# Altium schematic sheet Sheet1.SchDoc
size A; SheetNumber: 1; SheetTotal: 1
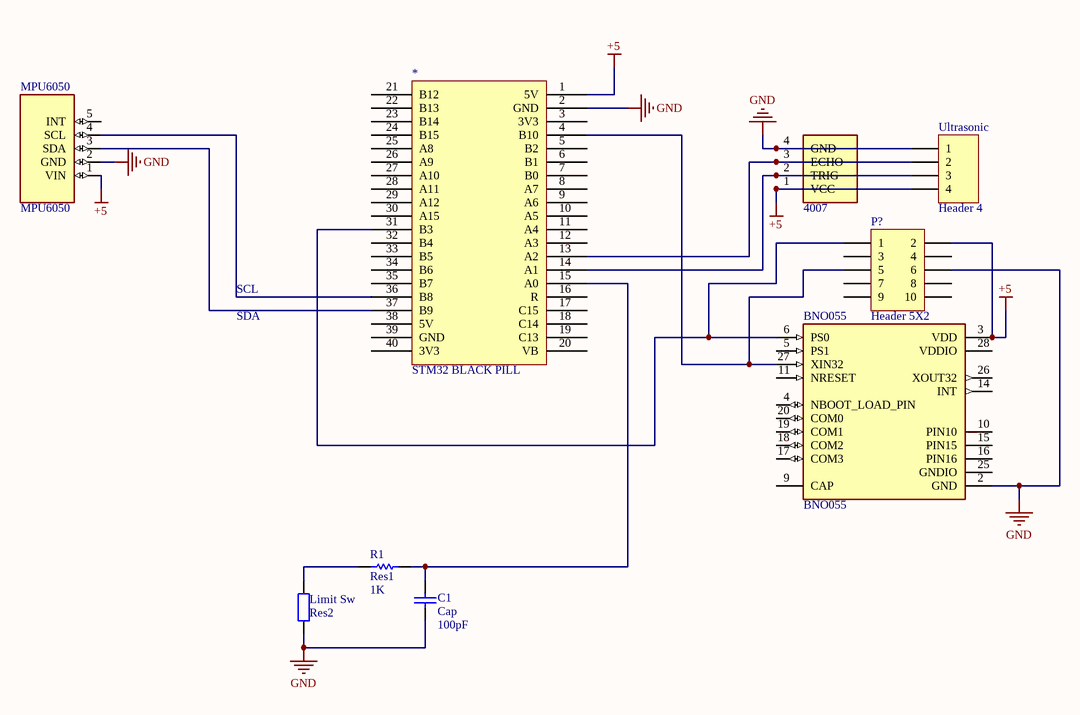
[diagram p0: Sheet1.SchDoc]

## Parts
*  STM32 BLACK PILL  [STM 32 Black Pill]
BNO055  BNO055  [LGA28R50P4X10_380X520X100]
C1  Cap  value 100pF  [RAD-0.3]
Limit_Sw  Res2  [AXIAL-0.4]
MPU6050  MPU6050  [SEN0142]
P?  Header 5X2  [HDR2X5]
R1  Res1  value 1K  [AXIAL-0.3]
Ultrasonic  Header 4  [HDR1X4]
  4007  [MODULE_4007]

## Nets
+5: *.1(5V) BNO055.3(VDD) MPU6050.1(VIN) P?.2 Ultrasonic.4 .1(VCC)
GND: *.2(GND) BNO055.2(GND) C1.1 Limit_Sw.1 MPU6050.2(GND) P?.6 Ultrasonic.1 .4(GND)
Net*_4: *.4(B10) BNO055.27(XIN32) P?.5
Net*_13: *.13(A2) Ultrasonic.2 .3(ECHO)
Net*_14: *.14(A1) Ultrasonic.3 .2(TRIG)
Net*_15: *.15(A0) C1.2 R1.2
Net*_31: *.31(B3) BNO055.6(PS0) P?.1
Net*_36: *.36(B8) MPU6050.4(SCL)
Net*_37: *.37(B9) MPU6050.3(SDA)
NetLimit_Sw_2: Limit_Sw.2 R1.1

Not connected (* = marked no-connect by the designer): * 3(3V3) 5(B2) 6(B1) 7(B0) 8(A7) 9(A6) 10(A5) 11(A4) 12(A3) 16(R) 17(C15) 18(C14) 19(C13) 20(VB) 21(B12) 22(B13) 23(B14) 24(B15) 25(A8) 26(A9) 27(A10) 28(A11) 29(A12) 30(A15) 32(B4) 33(B5) 34(B6) 35(B7) 38(5V) 39(GND) 40(3V3); BNO055 4(NBOOT_LOAD_PIN) 5(PS1) 9(CAP) 10(PIN10) 11(NRESET) 14(INT) 15(PIN15) 16(PIN16) 17(COM3) 18(COM2) 19(COM1) 20(COM0) 25(GNDIO) 26(XOUT32) 28(VDDIO); MPU6050 5(INT); P? 3 4 7 8 9 10

## Notes on the sheet
- SCL
- SDA

## Library data of the parts
BNO055 = BNO055: BNO055 9-axis Absolute Orientation Sensor ( SiP ) w/Sensors and Sensor Fusion; Package: None; Price: None; Value: *; MP: BNO055; Availability: Unavailable
C1 = Cap: Capacitor; Published: 8-Jun-2000; LatestRevisionDate: 17-Jul-2002; LatestRevisionNote: Re-released for DXP Platform.; PackageReference: RAD-0.3; Publisher: Altium Limited; PackageDescription: Radial Cap, Thru-Hole; 2 Leads; 0.3 in Pin Spacing
Limit_Sw = Res2: Resistor; Published: 8-Jun-2000; LatestRevisionDate: 17-Jul-2002; LatestRevisionNote: Re-released for DXP Platform.; PackageReference: AXIAL-0.4; Publisher: Altium Limited; PackageDescription: Axial Device, Thru-Hole; 2 Leads; 0.4 in Pin Spacing
MPU6050 = SEN0142: MPU-6050 series Accelerometer, Gyroscope, 3 Axis Sensor Evaluation Board; MF: DFRobot; SnapEDA_Link: https://www.snapeda.com/parts/SEN0142/DFRobot/view-part/?ref=snap; Package: None; Value: *; MP: SEN0142; Check_prices: https://www.snapeda.com/parts/SEN0142/DFRobot/view-part/?ref=eda
P? = Header 5X2: Header, 5-Pin, Dual row; LatestRevisionDate: 17-Jul-2002; LatestRevisionNote: Re-released for DXP Platform.; Publisher: Altium Limited
R1 = Res1: Resistor; Published: 8-Jun-2000; LatestRevisionDate: 17-Jul-2002; LatestRevisionNote: Re-released for DXP Platform.; PackageReference: AXIAL-0.3; Publisher: Altium Limited; PackageDescription: Axial Device, Thru-Hole; 2 Leads; 0.3 in Pin Spacing
Ultrasonic = Header 4: Header, 4-Pin; LatestRevisionDate: 17-Jul-2002; LatestRevisionNote: Re-released for DXP Platform.; Publisher: Altium Limited
 = 4007: Ultrasonic Distance Sensor - 3V or 5V - HC-SR04 compatible - RCWL-1601; MF: Adafruit Industries; SnapEDA_Link: https://www.snapeda.com/parts/4007/Adafruit+Industries+LLC/view-part/?ref=snap; Package: None; Value: *; MP: 4007; Check_prices: https://www.snapeda.com/parts/4007/Adafruit+Industries+LLC/view-part/?ref=eda